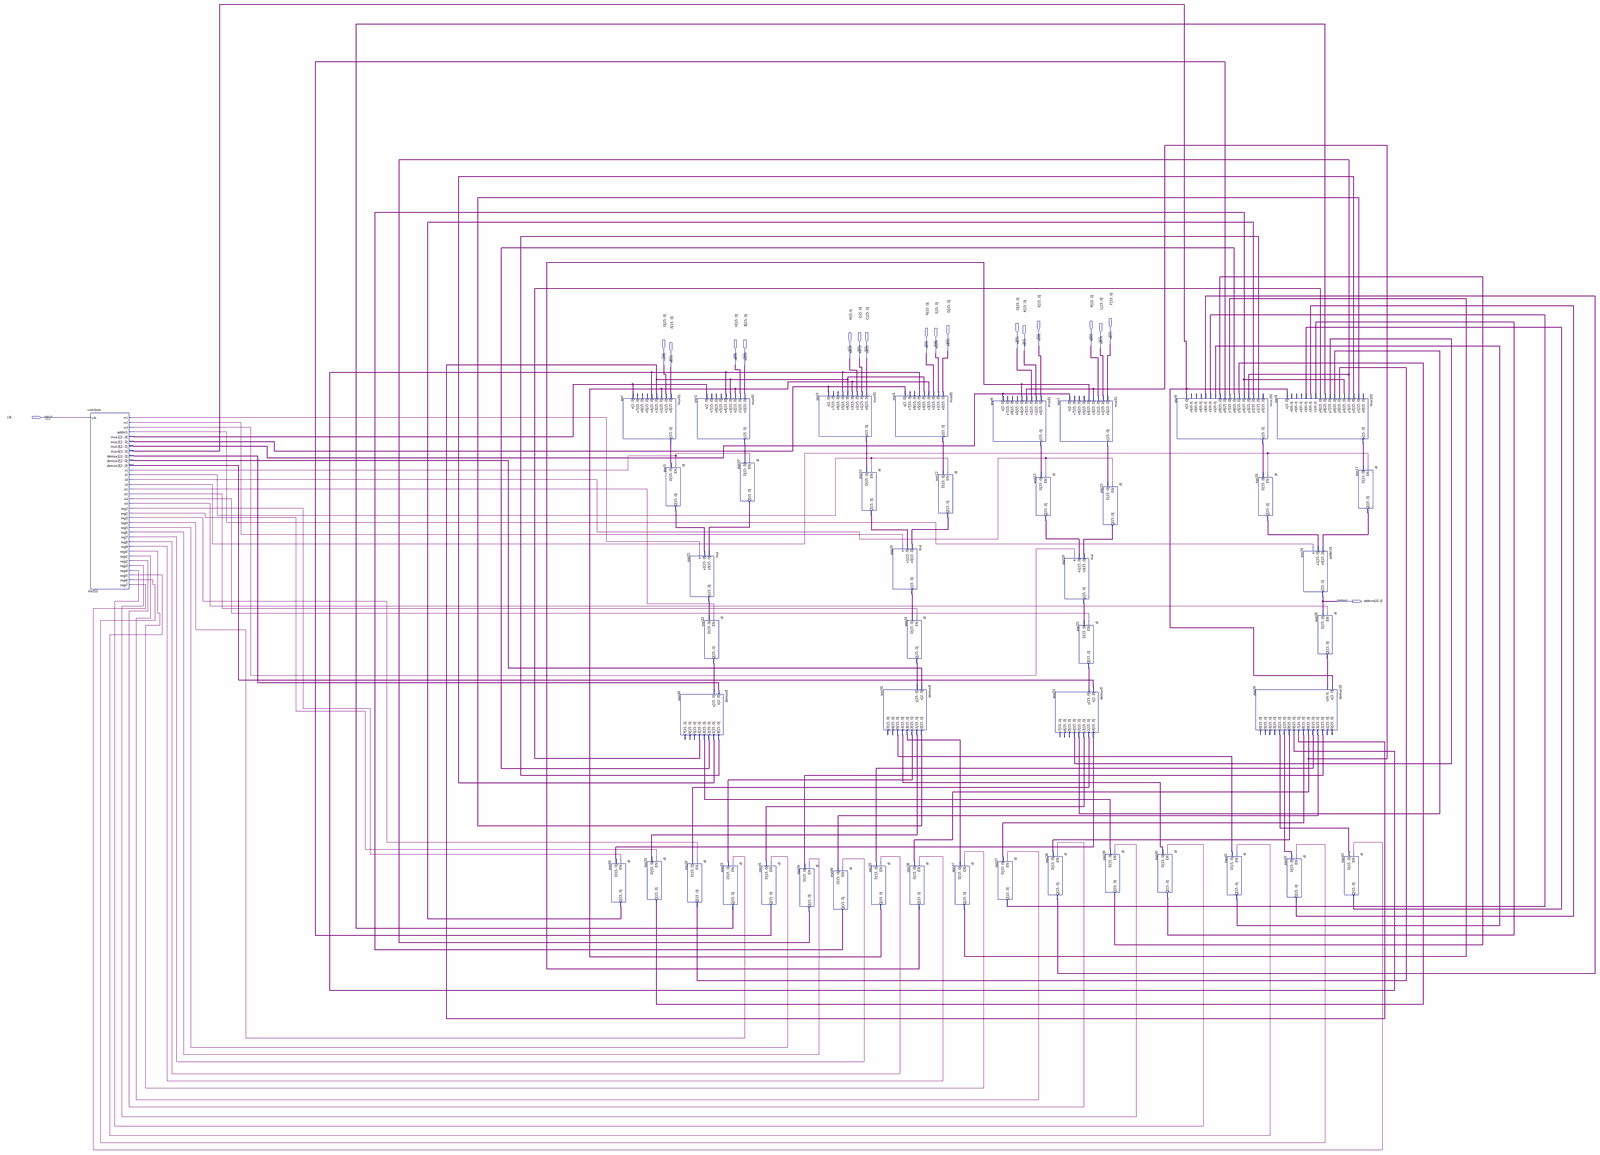
[diagram p0: schematic sheet, whole]
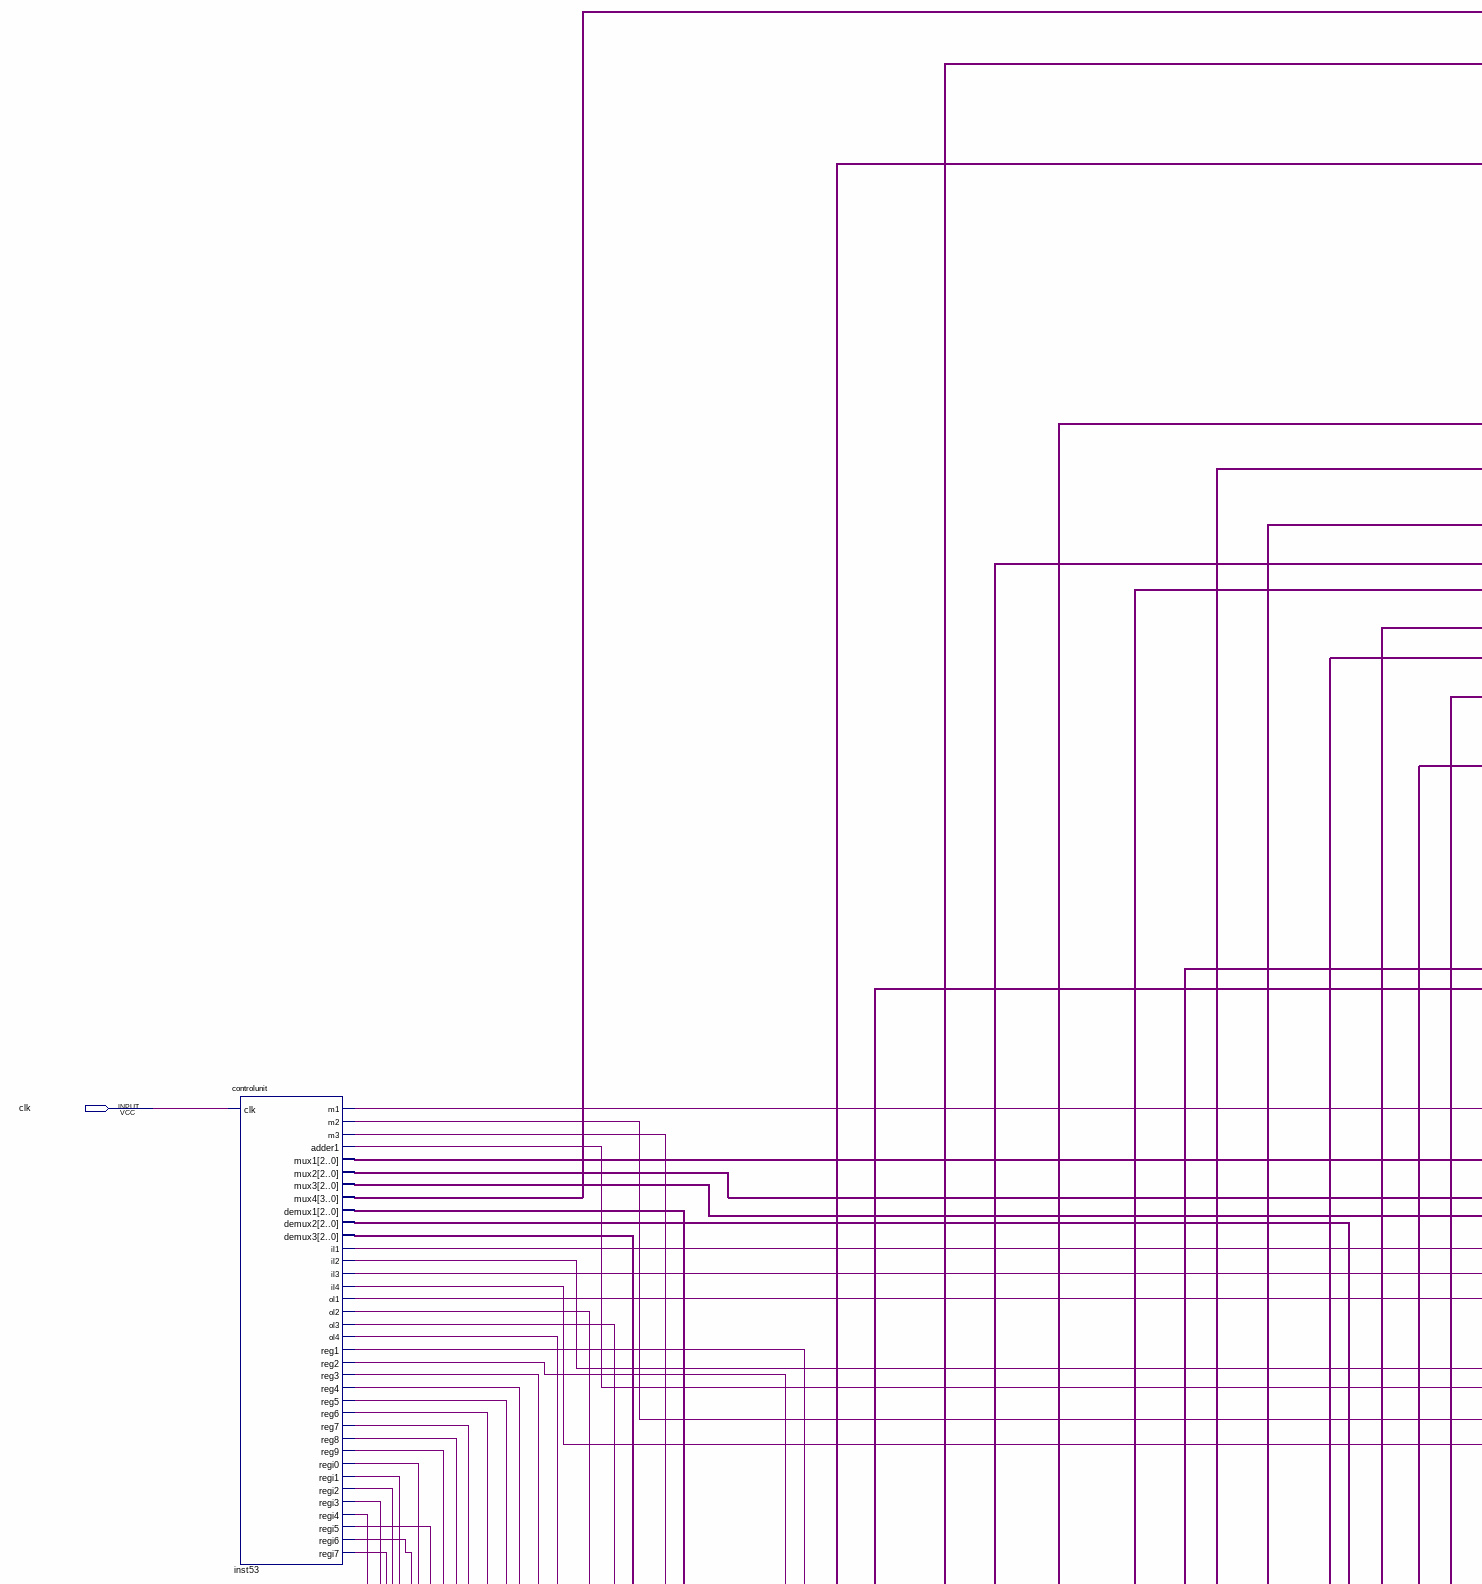
[diagram p1: schematic sheet, upper left part]
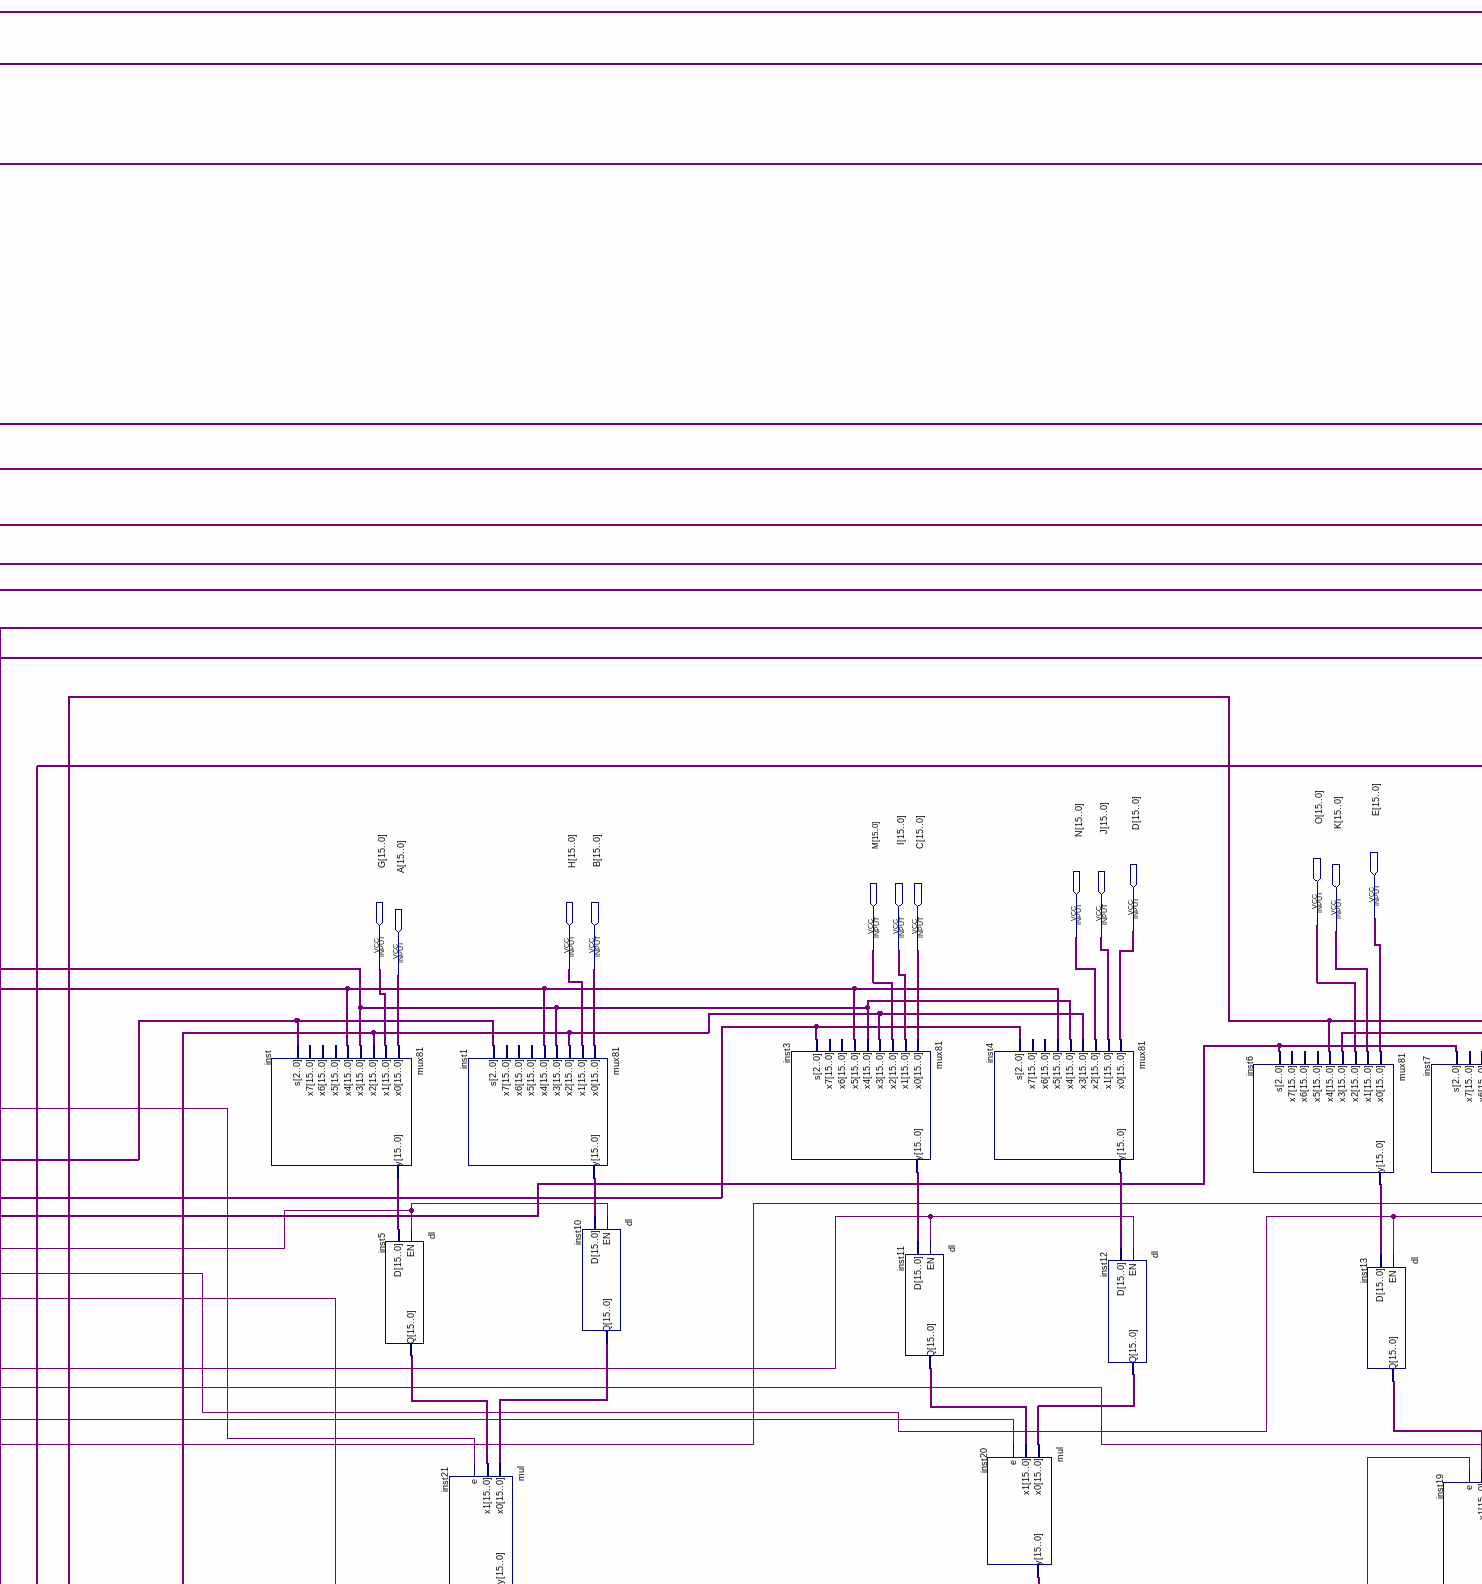
[diagram p2: schematic sheet, upper centre part]
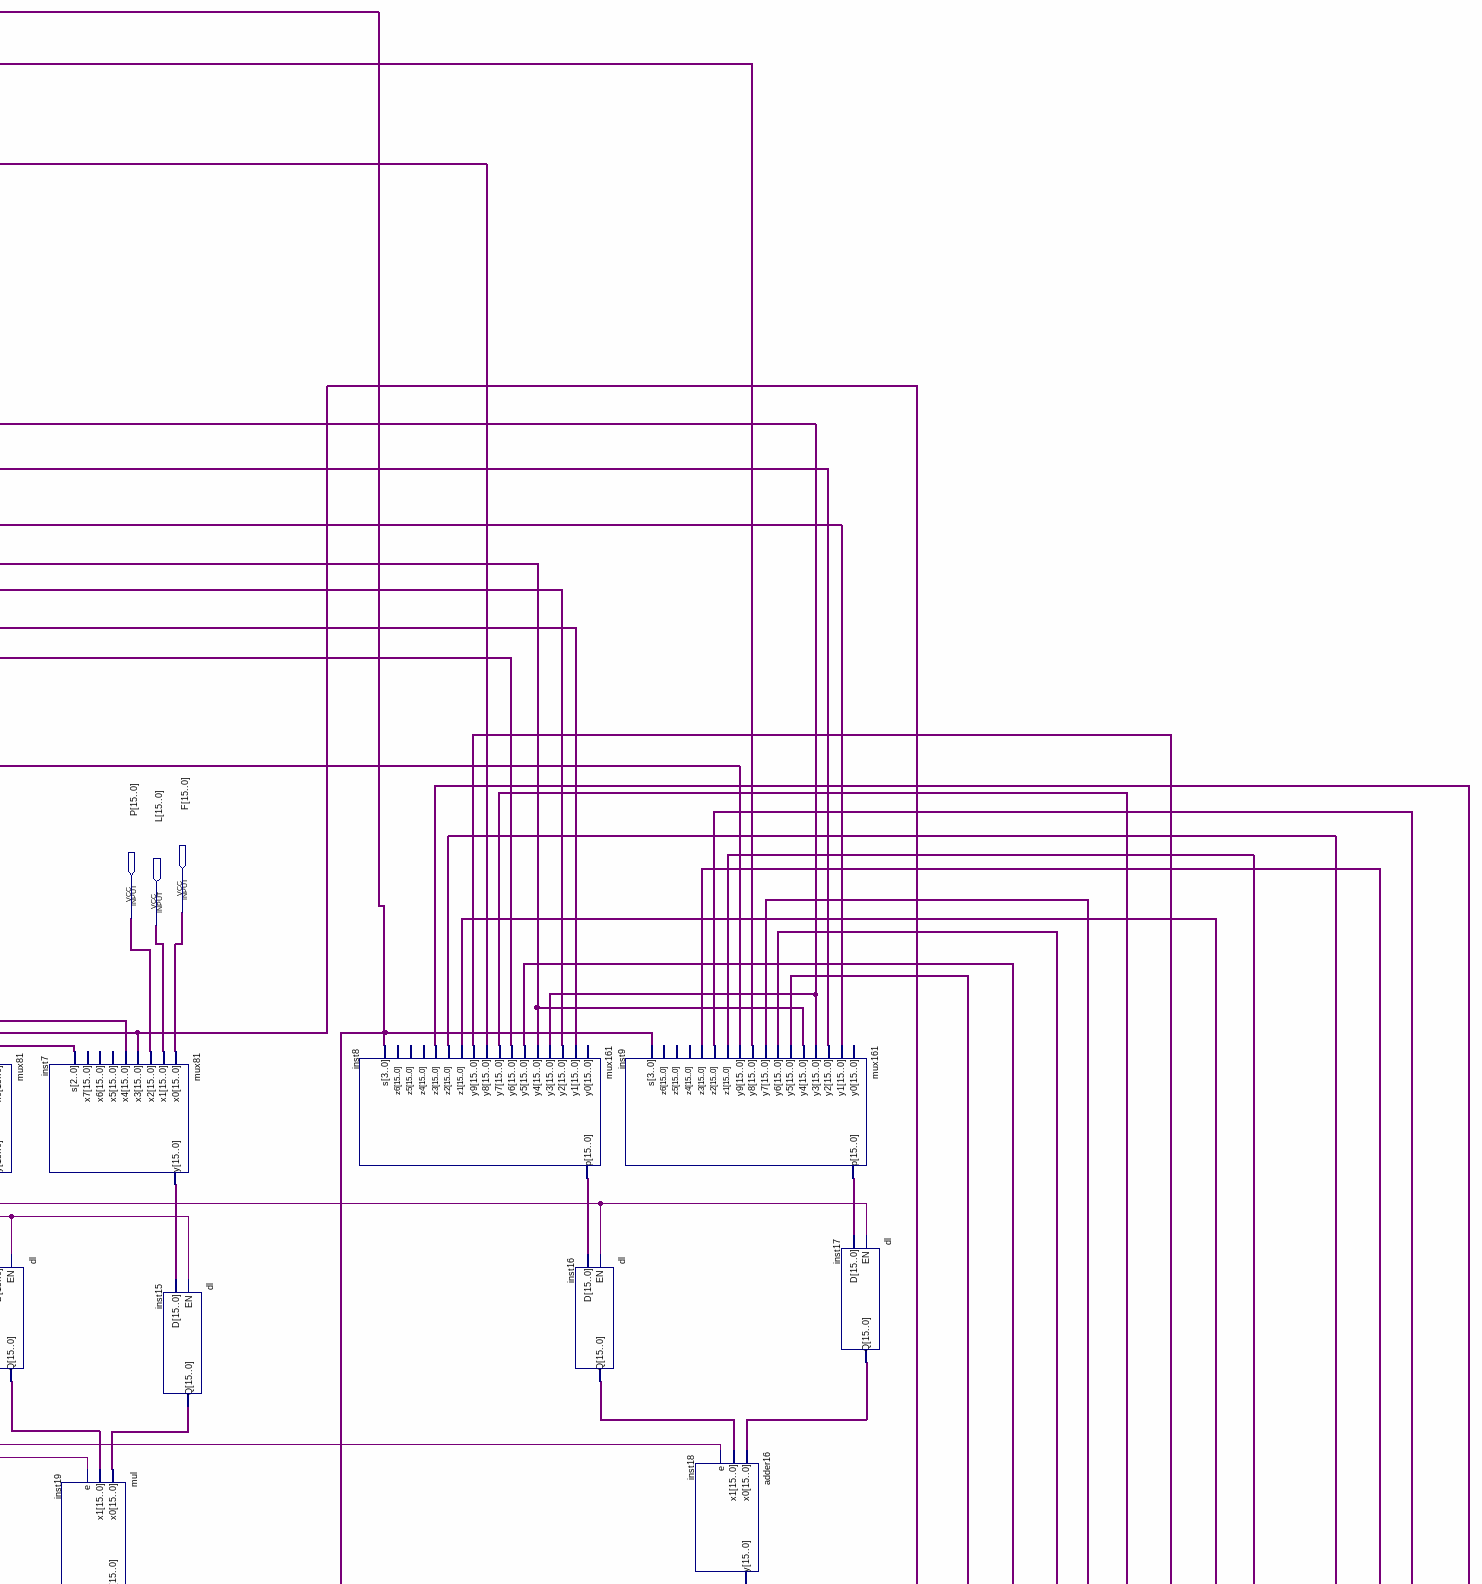
[diagram p3: schematic sheet, upper right part]
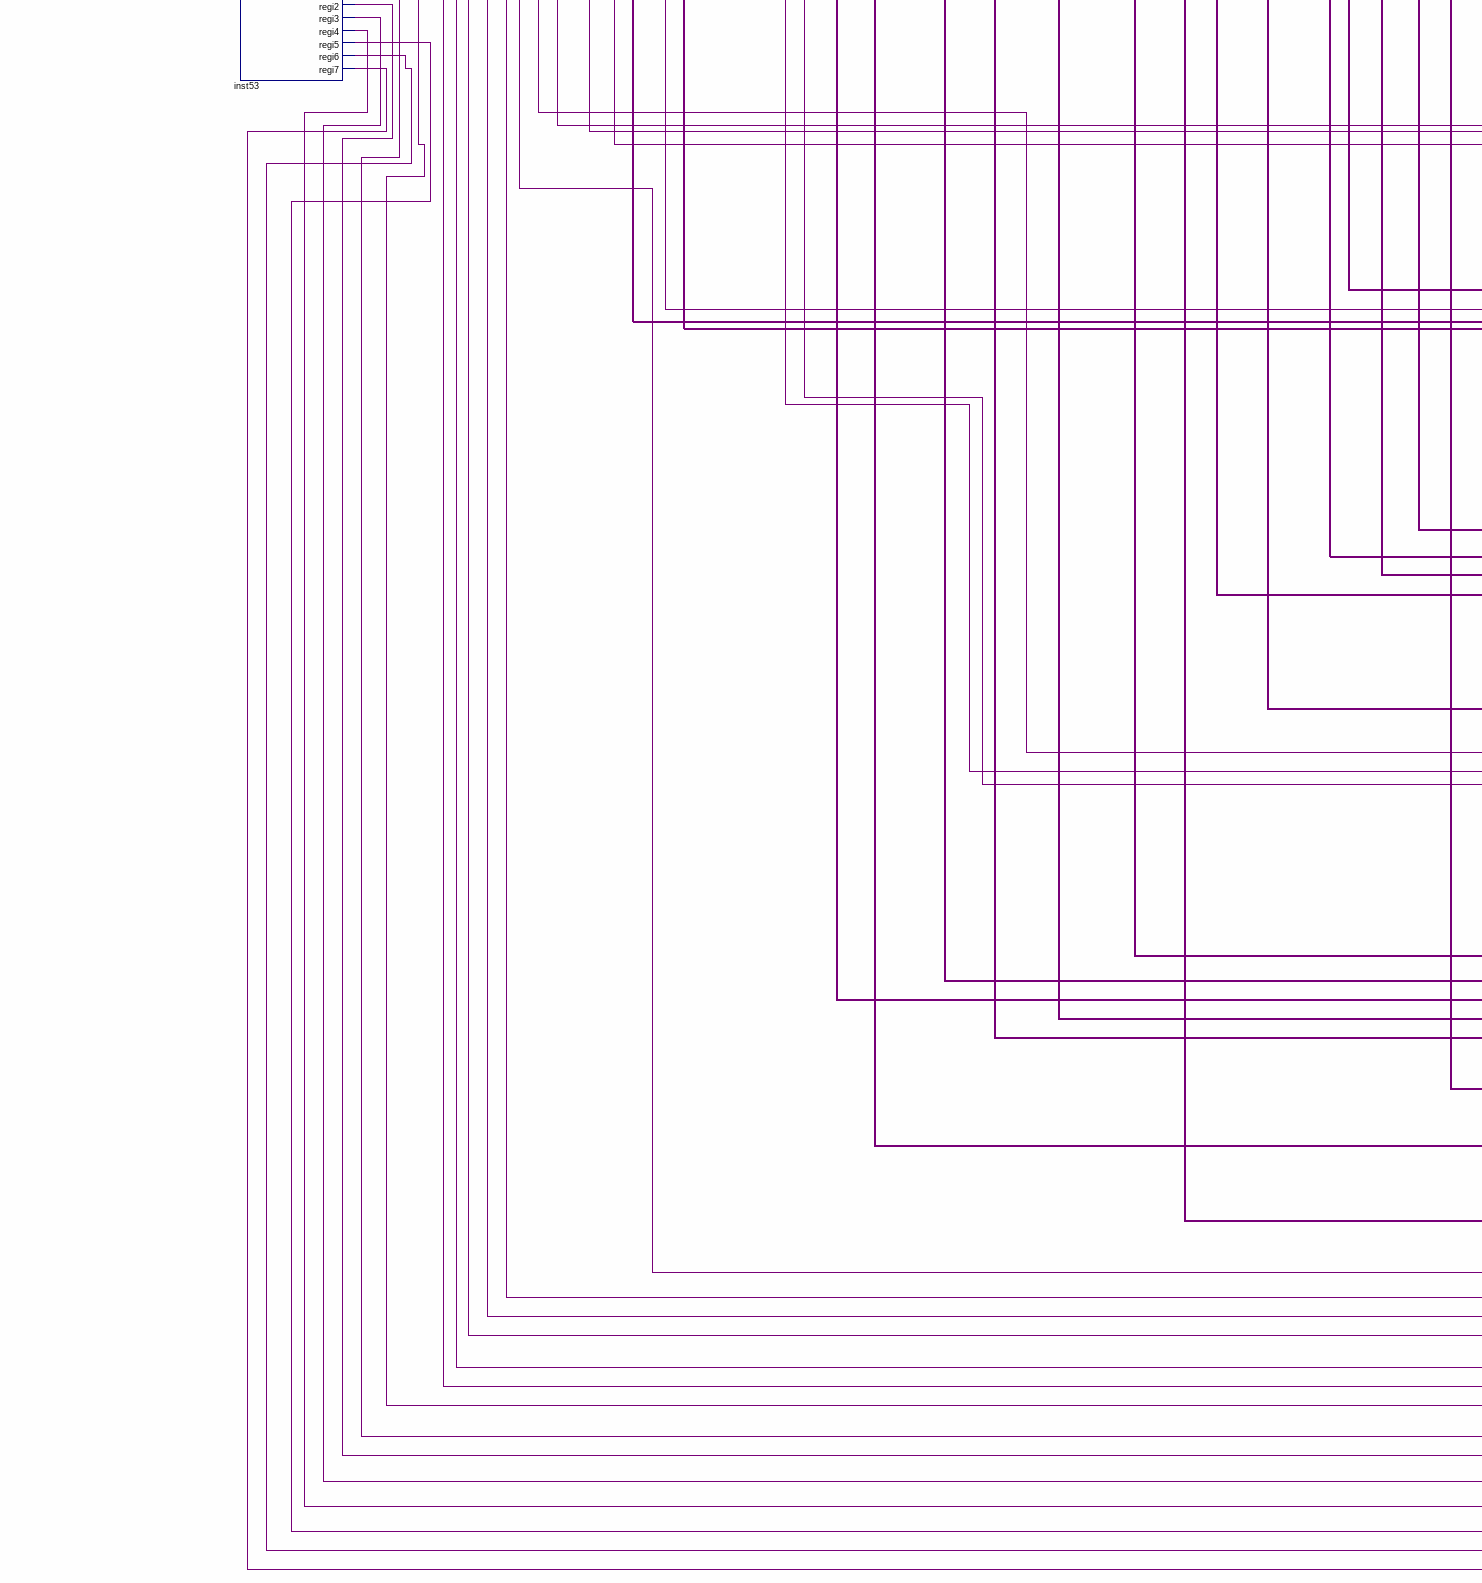
[diagram p4: schematic sheet, lower left part]
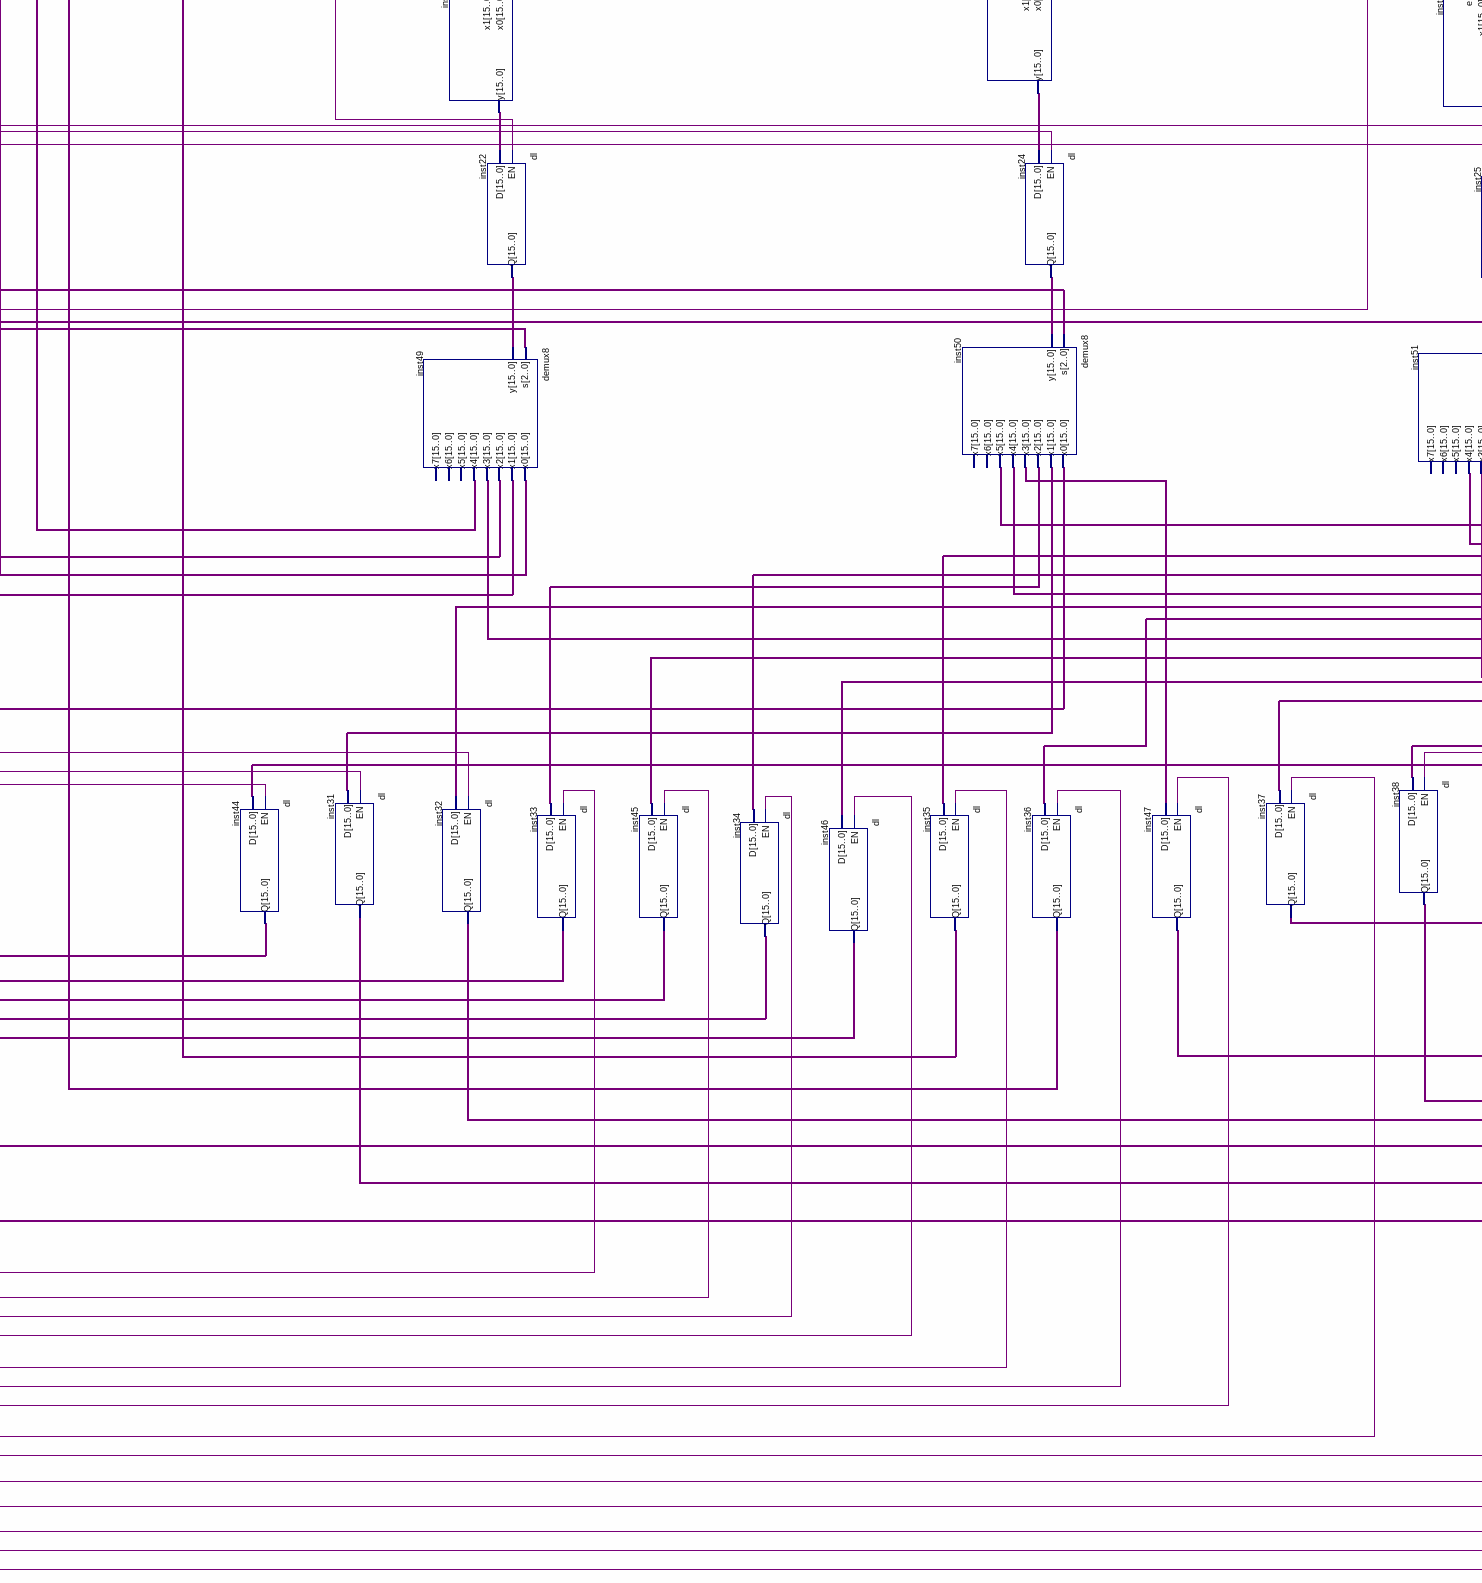
[diagram p5: schematic sheet, lower centre part]
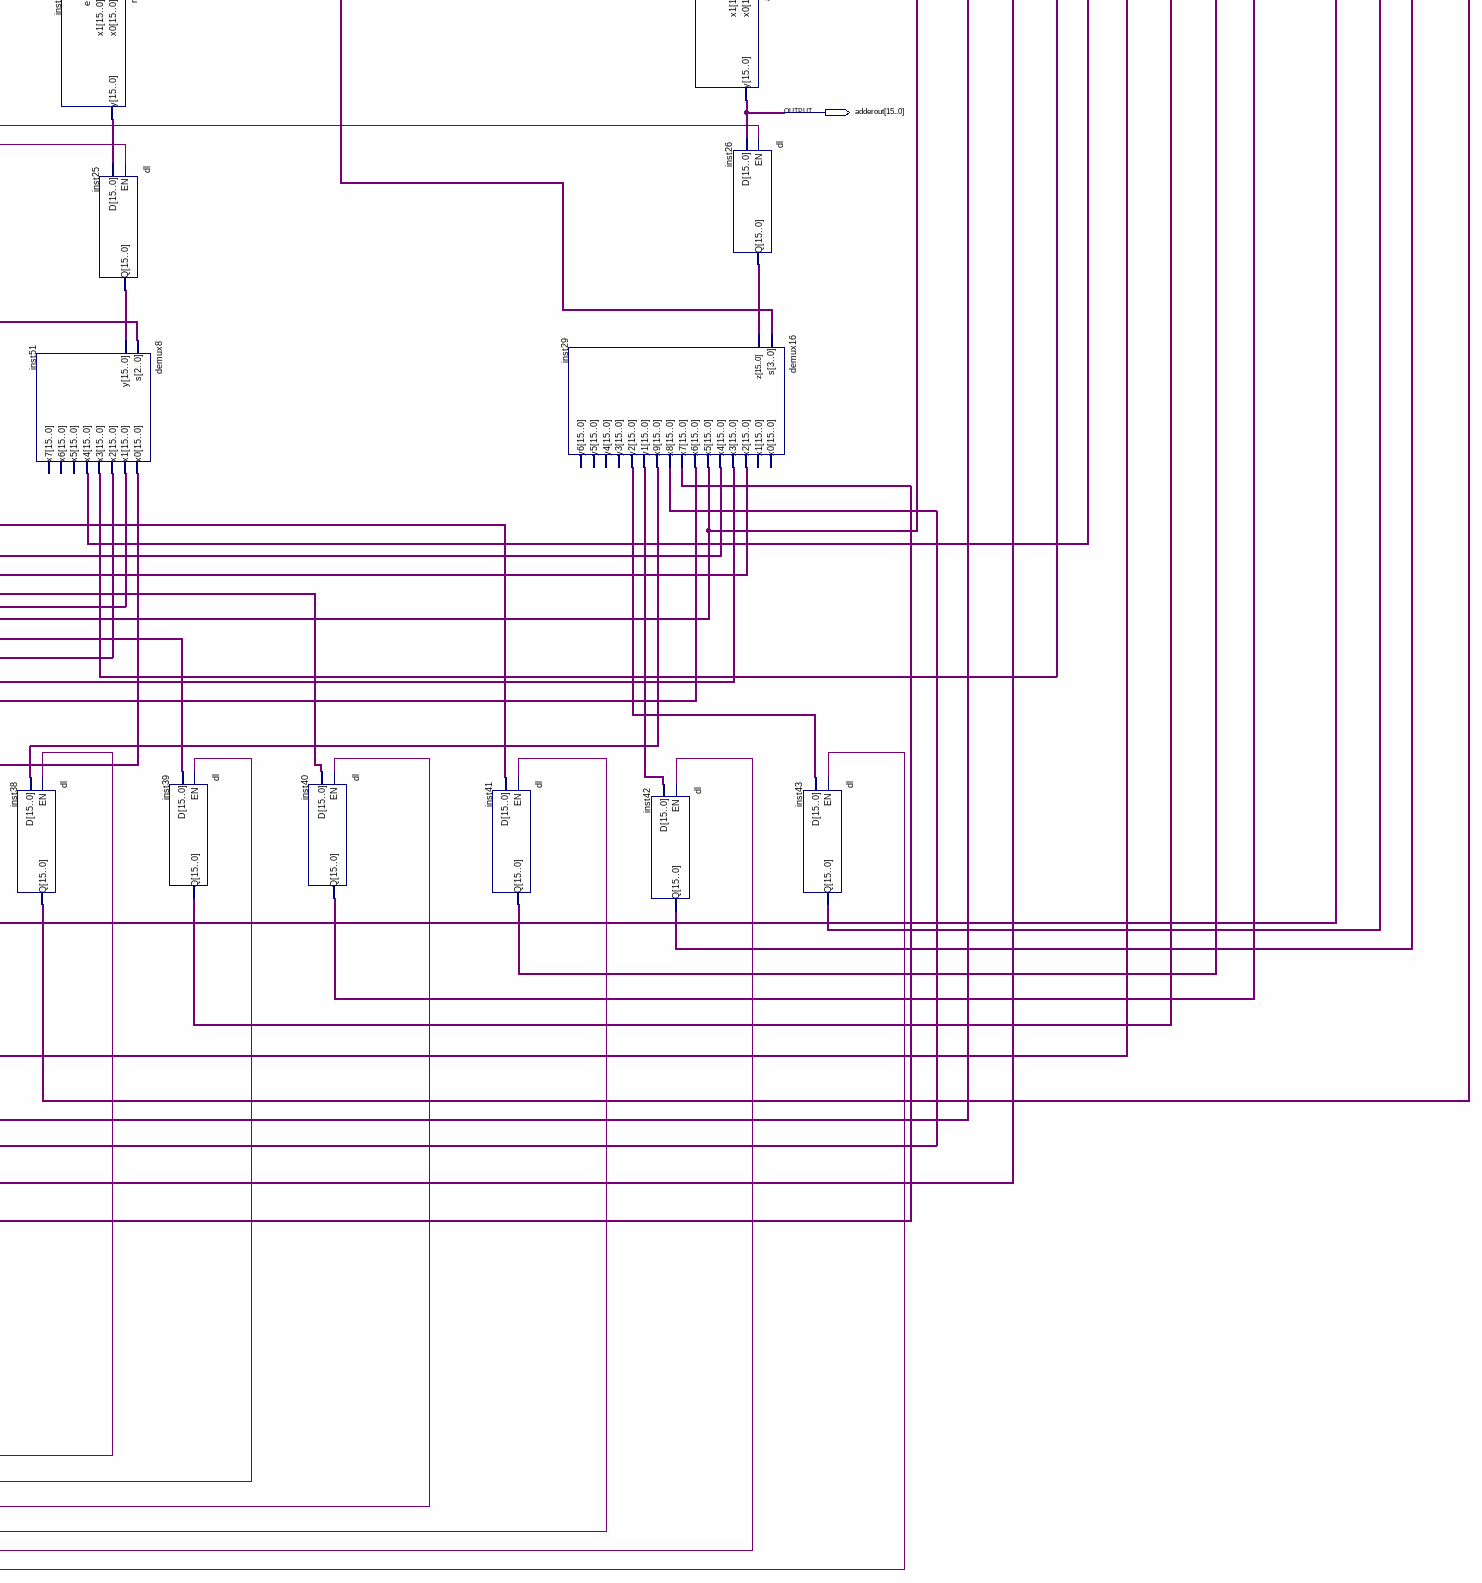
[diagram p6: schematic sheet, lower right part]
// Quartus schematic arf.bdf as structural Verilog: 46 symbols, 18 pins
module arf (
  input  [15:0] F,
  input  [15:0] E,
  input  [15:0] P,
  input  [15:0] O,
  input  [15:0] L,
  input  [15:0] D,
  input  [15:0] K,
  input  [15:0] N,
  input  [15:0] J,
  input  [15:0] M,
  input  [15:0] I,
  input  [15:0] C,
  input  [15:0] G,
  input  [15:0] H,
  input  [15:0] B,
  input  [15:0] A,
  input  clk,
  output [15:0] adderout
);

  wire inst53_adder1, inst53_il1, inst53_il2, inst53_il3, inst53_il4, inst53_m1, inst53_m2, inst53_m3,
       inst53_ol1, inst53_ol2, inst53_ol3, inst53_ol4, inst53_reg1, inst53_reg2, inst53_reg3, inst53_reg4,
       inst53_reg5, inst53_reg6, inst53_reg7, inst53_reg8, inst53_reg9, inst53_regi0, inst53_regi1,
       inst53_regi2, inst53_regi3, inst53_regi4, inst53_regi5, inst53_regi6, inst53_regi7;
  wire [2:0] inst53_demux1, inst53_demux2, inst53_demux3, inst53_mux1, inst53_mux2, inst53_mux3;
  wire [3:0] inst53_mux4;
  wire [15:0] inst1_y, inst3_y, inst4_y, inst5_q, inst6_y, inst7_y, inst8_p, inst9_p, inst10_q, inst11_q,
       inst12_q, inst13_q, inst15_q, inst16_q, inst17_q, inst19_y, inst20_y, inst21_y, inst22_q, inst24_q,
       inst25_q, inst26_q, inst29_x2, inst29_x3, inst29_x4, inst29_x5, inst29_x6, inst29_x7, inst29_x8,
       inst29_x9, inst29_y1, inst29_y2, inst31_q, inst32_q, inst33_q, inst34_q, inst35_q, inst36_q, inst37_q,
       inst38_q, inst39_q, inst40_q, inst41_q, inst42_q, inst43_q, inst44_q, inst45_q, inst46_q, inst47_q,
       inst49_x0, inst49_x1, inst49_x2, inst49_x3, inst49_x4, inst50_x0, inst50_x1, inst50_x2, inst50_x3,
       inst50_x4, inst50_x5, inst51_x0, inst51_x1, inst51_x2, inst51_x3, inst51_x4, inst_y;

  controlunit inst53 (
    .clk(clk), .m1(inst53_m1), .m2(inst53_m2), .m3(inst53_m3), .adder1(inst53_adder1), .mux1(inst53_mux1),
    .mux2(inst53_mux2), .mux3(inst53_mux3), .mux4(inst53_mux4), .demux1(inst53_demux1),
    .demux2(inst53_demux2), .demux3(inst53_demux3), .il1(inst53_il1), .il2(inst53_il2), .il3(inst53_il3),
    .il4(inst53_il4), .ol1(inst53_ol1), .ol2(inst53_ol2), .ol3(inst53_ol3), .ol4(inst53_ol4),
    .reg1(inst53_reg1), .reg2(inst53_reg2), .reg3(inst53_reg3), .reg4(inst53_reg4), .reg5(inst53_reg5),
    .reg6(inst53_reg6), .reg7(inst53_reg7), .reg8(inst53_reg8), .reg9(inst53_reg9), .regi0(inst53_regi0),
    .regi1(inst53_regi1), .regi2(inst53_regi2), .regi3(inst53_regi3), .regi4(inst53_regi4),
    .regi5(inst53_regi5), .regi6(inst53_regi6), .regi7(inst53_regi7));
  dl inst44 (.EN(inst53_reg1), .D(inst51_x0), .Q(inst44_q));
  mux81 inst (
    .x0(A), .x1(G), .x2(inst35_q), .x3(inst29_x7), .x4(inst29_x8), .s(inst53_mux1), .y(inst_y));  // open: x5, x6, x7
  dl inst31 (.EN(inst53_reg2), .D(inst50_x1), .Q(inst31_q));
  dl inst5 (.EN(inst53_il1), .D(inst_y), .Q(inst5_q));
  demux8 inst49 (
    .s(inst53_demux1), .y(inst22_q), .x0(inst49_x0), .x1(inst49_x1), .x2(inst49_x2), .x3(inst49_x3),
    .x4(inst49_x4));  // open: x5, x6, x7
  dl inst32 (.EN(inst53_reg3), .D(inst51_x1), .Q(inst32_q));
  mux81 inst1 (
    .x0(B), .x1(H), .x2(inst35_q), .x3(inst29_x7), .x4(inst29_x8), .s(inst53_mux1), .y(inst1_y));  // open: x5, x6, x7
  mul inst21 (.x0(inst10_q), .x1(inst5_q), .e(inst53_m1), .y(inst21_y));
  dl inst22 (.EN(inst53_ol1), .D(inst21_y), .Q(inst22_q));
  dl inst33 (.EN(inst53_reg4), .D(inst50_x2), .Q(inst33_q));
  dl inst10 (.EN(inst53_il1), .D(inst1_y), .Q(inst10_q));
  dl inst45 (.EN(inst53_reg5), .D(inst51_x2), .Q(inst45_q));
  dl inst34 (.EN(inst53_reg6), .D(inst29_x2), .Q(inst34_q));
  mux81 inst3 (
    .x0(C), .x1(I), .x2(M), .x3(inst35_q), .x4(inst29_x7), .x5(inst29_x8), .s(inst53_mux2), .y(inst3_y));  // open: x6, x7
  dl inst46 (.EN(inst53_reg7), .D(inst29_x3), .Q(inst46_q));
  dl inst11 (.EN(inst53_il2), .D(inst3_y), .Q(inst11_q));
  dl inst35 (.EN(inst53_reg8), .D(inst29_x4), .Q(inst35_q));
  mux81 inst4 (
    .x0(D), .x1(J), .x2(N), .x3(inst35_q), .x4(inst29_x7), .x5(inst29_x8), .s(inst53_mux2), .y(inst4_y));  // open: x6, x7
  mul inst20 (.x0(inst12_q), .x1(inst11_q), .e(inst53_m2), .y(inst20_y));
  demux8 inst50 (
    .s(inst53_demux2), .y(inst24_q), .x0(inst50_x0), .x1(inst50_x1), .x2(inst50_x2), .x3(inst50_x3),
    .x4(inst50_x4), .x5(inst50_x5));  // open: x6, x7
  dl inst24 (.EN(inst53_ol2), .D(inst20_y), .Q(inst24_q));
  dl inst36 (.EN(inst53_reg9), .D(inst29_x5), .Q(inst36_q));
  dl inst12 (.EN(inst53_il2), .D(inst4_y), .Q(inst12_q));
  dl inst47 (.EN(inst53_regi0), .D(inst50_x3), .Q(inst47_q));
  mux81 inst6 (
    .x0(E), .x1(K), .x2(O), .x3(inst29_x5), .x4(inst36_q), .s(inst53_mux3), .y(inst6_y));  // open: x5, x6, x7
  dl inst37 (.EN(inst53_regi1), .D(inst29_x6), .Q(inst37_q));
  dl inst13 (.EN(inst53_il3), .D(inst6_y), .Q(inst13_q));
  dl inst38 (.EN(inst53_regi2), .D(inst29_x9), .Q(inst38_q));
  mux81 inst7 (
    .x0(F), .x1(L), .x2(P), .x3(inst29_x5), .x4(inst36_q), .s(inst53_mux3), .y(inst7_y));  // open: x5, x6, x7
  mul inst19 (.x0(inst15_q), .x1(inst13_q), .e(inst53_m3), .y(inst19_y));
  demux8 inst51 (
    .s(inst53_demux3), .y(inst25_q), .x0(inst51_x0), .x1(inst51_x1), .x2(inst51_x2), .x3(inst51_x3),
    .x4(inst51_x4));  // open: x5, x6, x7
  dl inst25 (.EN(inst53_ol3), .D(inst19_y), .Q(inst25_q));
  dl inst15 (.EN(inst53_il3), .D(inst7_y), .Q(inst15_q));
  dl inst39 (.EN(inst53_regi3), .D(inst49_x3), .Q(inst39_q));
  dl inst40 (.EN(inst53_regi4), .D(inst50_x4), .Q(inst40_q));
  mux161 inst8 (
    .y1(inst49_x0), .y2(inst44_q), .y3(inst34_q), .y4(inst46_q), .y5(inst31_q), .y6(inst49_x2),
    .y7(inst47_q), .y8(inst45_q), .y9(inst39_q), .z1(inst41_q), .z2(inst37_q), .z3(inst38_q),
    .s(inst53_mux4), .p(inst8_p));  // open: y0, z4, z5, z6
  dl inst41 (.EN(inst53_regi5), .D(inst50_x5), .Q(inst41_q));
  dl inst16 (.EN(inst53_il4), .D(inst8_p), .Q(inst16_q));
  demux16 inst29 (
    .s(inst53_mux4), .z(inst26_q), .x2(inst29_x2), .x3(inst29_x3), .x4(inst29_x4), .x5(inst29_x5),
    .x6(inst29_x6), .x7(inst29_x7), .x8(inst29_x8), .x9(inst29_x9), .y1(inst29_y1), .y2(inst29_y2));  // open: x0, x1, y3, y4, y5, y6
  mux161 inst9 (
    .y1(inst50_x0), .y2(inst49_x1), .y3(inst34_q), .y4(inst46_q), .y5(inst32_q), .y6(inst51_x3),
    .y7(inst51_x4), .y8(inst33_q), .y9(inst49_x4), .z1(inst40_q), .z2(inst42_q), .z3(inst43_q),
    .s(inst53_mux4), .p(inst9_p));  // open: y0, z4, z5, z6
  dl inst42 (.EN(inst53_regi6), .D(inst29_y1), .Q(inst42_q));
  adder16 inst18 (.x0(inst17_q), .x1(inst16_q), .e(inst53_adder1), .y(adderout));
  dl inst26 (.EN(inst53_ol4), .D(adderout), .Q(inst26_q));
  dl inst43 (.EN(inst53_regi7), .D(inst29_y2), .Q(inst43_q));
  dl inst17 (.EN(inst53_il4), .D(inst9_p), .Q(inst17_q));
endmodule
